# EAGLE design MLP_ESPControlBoard_Rev_1 (EAGLE 7.6.0)
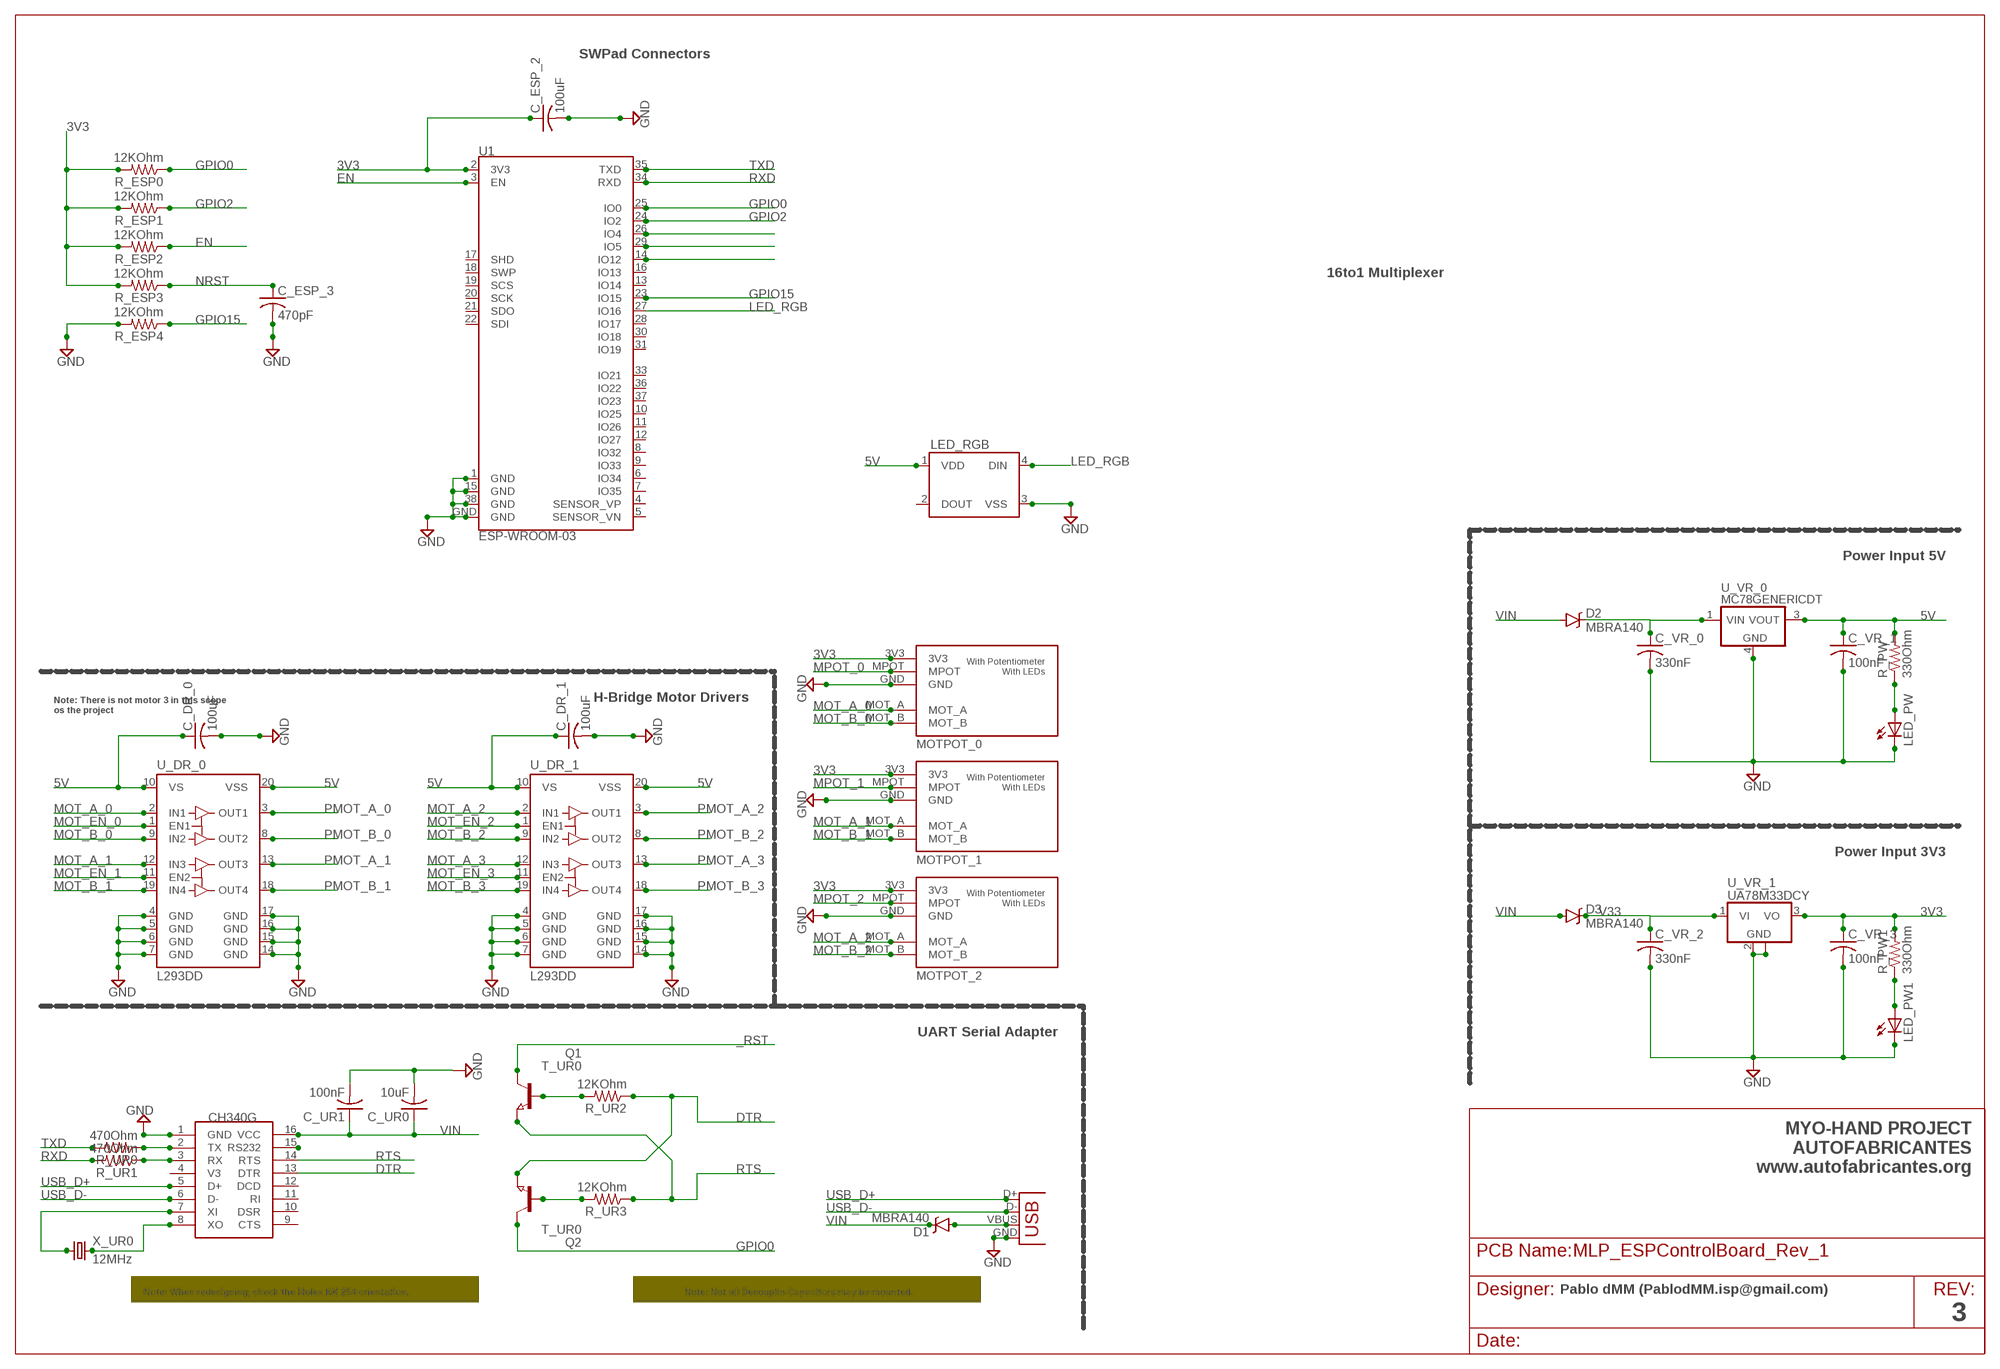
[diagram p0: schematic, sheet 1]

## Parts
C_DR_0  100uF  C-USC0805K  [C0805K]
C_DR_1  100uF  C-USC0805K  [C0805K]
C_ESP_2  100uF  C-USC0805K  [C0805K]
C_ESP_3  470pF  C-USC0805K  [C0805K]
C_UR0  10uF  C-USC0805K  [C0805K]
C_UR1  100nF  C-USC0805K  [C0805K]
C_VR_0  330nF  C-USC1206K  [C1206K]
C_VR_1  100nF  C-USC1206K  [C1206K]
C_VR_2  330nF  C-USC1206K  [C1206K]
C_VR_3  100nF  C-USC1206K  [C1206K]
D1  MBRA140  [SMA-DIODE]
D2  MBRA140  [SMA-DIODE]
D3  MBRA140  [SMA-DIODE]
LED_PW  LEDSMT1206  [1206]
LED_PW1  LEDSMT1206  [1206]
LED_RGB  WS2812B  [WS2812B]
MOTPOT_0  POLOLU_MOT_POT  [POLOLU_MOT_POT]
MOTPOT_1  POLOLU_MOT_POT  [POLOLU_MOT_POT]
MOTPOT_2  POLOLU_MOT_POT  [POLOLU_MOT_POT]
Q1  T_UR0  NPN-TRANSISTOR_SOT23  [SOT23]
Q2  T_UR0  NPN-TRANSISTOR_SOT23  [SOT23]
R_ESP0  12KOhm  R-US_M0805  [M0805]
R_ESP1  12KOhm  R-US_M0805  [M0805]
R_ESP2  12KOhm  R-US_M0805  [M0805]
R_ESP3  12KOhm  R-US_M0805  [M0805]
R_ESP4  12KOhm  R-US_M0805  [M0805]
R_PW  330Ohm  R-US_M1206  [M1206]
R_PW1  330Ohm  R-US_M1206  [M1206]
R_UR0  470Ohm  R-US_M1206  [M1206]
R_UR1  470Ohm  R-US_M1206  [M1206]
R_UR2  12KOhm  R-US_M1206  [M1206]
R_UR3  12KOhm  R-US_M1206  [M1206]
U1  ESP-WROOM-03  [ESP-WROOM-03]
U_DR_0  L293DD  [SO20]
U_DR_1  L293DD  [SO20]
U_UR0  CH340G  [SOIC16]
U_VR_0  MC78GENERICDT  [DPAK-3]
U_VR_1  UA78M33DCY  [SOT223]
X1  USB-MICROB  [USB-MICROB]
X_UR0  12MHz  CRYSTALCTS406  [CTS406]

## Nets
3V3: C_ESP_2.1 C_VR_3.1 MOTPOT_0.3V3 MOTPOT_1.3V3 MOTPOT_2.3V3 R_ESP0.2 R_ESP1.2 R_ESP2.2 R_ESP3.2 R_PW1.2 U1.2(3V3) U_VR_1.3(VO)
5V [GND]: C_DR_0.1 C_DR_1.1 C_VR_1.1 LED_RGB.1(VDD) R_PW.2 U_DR_0.10(VS) U_DR_0.20(VSS) U_DR_1.10(VS) U_DR_1.20(VSS) U_VR_0.3(VOUT)
_RST: Q1.3(C)
DTR: Q2.2(E) R_UR2.1 U_UR0.13(DTR)
EN: R_ESP2.1 U1.3(EN)
GND [GND]: C_DR_0.2 C_DR_1.2 C_ESP_2.2 C_ESP_3.2 C_UR0.2 C_UR1.2 C_VR_0.2 C_VR_1.2 C_VR_2.2 C_VR_3.2 LED_PW1.C LED_PW.C LED_RGB.3(VSS) MOTPOT_0.GND MOTPOT_1.GND MOTPOT_2.GND R_ESP4.2 U1.1(GND) U1.15(GND) U1.38(GND) U1.GND U_DR_0.4(GND) U_DR_0.5(GND) U_DR_0.6(GND) U_DR_0.7(GND) U_DR_0.14(GND) U_DR_0.15(GND) U_DR_0.16(GND) U_DR_0.17(GND) U_DR_1.4(GND) U_DR_1.5(GND) U_DR_1.6(GND) U_DR_1.7(GND) U_DR_1.14(GND) U_DR_1.15(GND) U_DR_1.16(GND) U_DR_1.17(GND) U_UR0.1(GND) U_VR_0.4(GND) U_VR_1.2(GND) U_VR_1.4(GND) X1.GND
GPIO0: Q2.3(C) R_ESP0.1 U1.25(IO0)
GPIO2: R_ESP1.1 U1.24(IO2)
GPIO15: R_ESP4.1 U1.23(IO15)
LED_RGB: LED_RGB.4(DIN) U1.27(IO16)
MOT_A_0: MOTPOT_0.MOT_A U_DR_0.2(IN1)
MOT_A_1: MOTPOT_1.MOT_A U_DR_0.12(IN3)
MOT_A_2: MOTPOT_2.MOT_A U_DR_1.2(IN1)
MOT_A_3: U_DR_1.12(IN3)
MOT_B_0: MOTPOT_0.MOT_B U_DR_0.9(IN2)
MOT_B_1: MOTPOT_1.MOT_B U_DR_0.19(IN4)
MOT_B_2: MOTPOT_2.MOT_B U_DR_1.9(IN2)
MOT_B_3: U_DR_1.19(IN4)
MOT_EN_0: U_DR_0.1(EN1)
MOT_EN_1: U_DR_0.11(EN2)
MOT_EN_2: U_DR_1.1(EN1)
MOT_EN_3: U_DR_1.11(EN2)
MPOT_0: MOTPOT_0.MPOT
MPOT_1: MOTPOT_1.MPOT
MPOT_2: MOTPOT_2.MPOT
N$2: U_UR0.15(RS232)
N$3: Q2.1(B) R_UR3.2
N$4: Q1.1(B) R_UR2.2
N$5: LED_PW.A R_PW.1
N$7: U_UR0.7(XI) X_UR0.1
N$8: LED_PW1.A R_PW1.1
N$10: U1.26(IO4)
N$12: R_UR0.1 U_UR0.2(TX)
N$13: R_UR1.1 U_UR0.3(RX)
N$14: U_UR0.8(XO) X_UR0.3
N$15: D1.A X1.VBUS
N$16: U1.29(IO5)
N$17: U1.14(IO12)
NRST: C_ESP_3.1 R_ESP3.1
PMOT_A_0: U_DR_0.3(OUT1)
PMOT_A_1: U_DR_0.13(OUT3)
PMOT_A_2: U_DR_1.3(OUT1)
PMOT_A_3: U_DR_1.13(OUT3)
PMOT_B_0: U_DR_0.8(OUT2)
PMOT_B_1: U_DR_0.18(OUT4)
PMOT_B_2: U_DR_1.8(OUT2)
PMOT_B_3: U_DR_1.18(OUT4)
RTS: Q1.2(E) R_UR3.1 U_UR0.14(RTS)
RXD: R_UR1.2 U1.34(RXD)
TXD: R_UR0.2 U1.35(TXD)
USB_D+: U_UR0.5(D+) X1.D+
USB_D-: U_UR0.6(D-) X1.D-
V5: C_VR_0.1 D2.C U_VR_0.1(VIN)
V33: C_VR_2.1 D3.C U_VR_1.1(VI)
VIN: C_UR0.1 C_UR1.1 D1.C D2.A D3.A U_UR0.16(VCC)
Unconnected: LED_RGB.2(DOUT) U1.4(SENSOR_VP) U1.5(SENSOR_VN) U1.6(IO34) U1.7(IO35) U1.8(IO32) U1.9(IO33) U1.10(IO25) U1.11(IO26) U1.12(IO27) U1.13(IO14) U1.16(IO13) U1.17(SHD) U1.18(SWP) U1.19(SCS) U1.20(SCK) U1.21(SDO) U1.22(SDI) U1.28(IO17) U1.30(IO18) U1.31(IO19) U1.33(IO21) U1.36(IO22) U1.37(IO23) U_UR0.4(V3) U_UR0.9(CTS) U_UR0.10(DSR) U_UR0.11(RI) U_UR0.12(DCD)

## Notes on the sheet
- SWPad Connectors
- 16to1 Multiplexer
- Power Input 5V
- Note: There is not motor 3 in this scope
  os the project
- H-Bridge Motor Drivers
- Power Input 3V3
- UART Serial Adapter
- MYO-HAND PROJECT
  AUTOFABRICANTES
  www.autofabricantes.org
- Note: When redesigning, check the Molex KK 254 orientation. | Note: Not all Decouplin Capacitors may be mounted. | Pablo dMM (PablodMM.isp@gmail.com)
- 3

## Library data of the parts
C_DR_0 C_DR_1 C_ESP_2 C_ESP_3 C_UR0 C_UR1 C_VR_0 C_VR_1-C_VR_3 = adafruit:C-US: CAPACITOR, American symbol
D1-D3 = SparkFun-DiscreteSemi:MBRA140: 40V, 1A Schottky rectifier SMA/DO-214AC package DIO-08053; PROD_ID: DIO-08053
LED_PW LED_PW1 = adafruit:LED: LED OSRAM: - CHIPLED LG R971, LG N971, LY N971, LG Q971, LY Q971, LO R971, LY R971 LH N974, LH R974 LS Q976, LO Q976, LY Q976 LO Q996 - Hyper CHIPLED LW Q18S LB Q993, LB Q99A, LB R99A - SideLED LS A670, LO A670, LY A670, LG A670, LP A670 LB A673, LV A673, LT A673, LW A673 LH A674 LY A675 LS A676, LA A676, LO A676, LY A676, LW A676 LS A679, LY A679, LG A679 - Hyper Micro SIDELED® LS Y876, LA Y876, LO Y876, LY Y876 LT Y87S - SmartLED LW L88C, LW L88S LB L89C, LB L89S, LG L890 LS L89K, LO L89K, LY L89K LS L896, LA L896, LO L896, LY L896 - TOPLED LS T670, LO T670, LY T670, LG T670, LP T670 LSG T670, LSP T670, LSY T670, LOP T670, LYG T670 LG T671, LOG T671, LSG T671 LB T673, LV T673, LT T673, LW T673 LH T674 LS T676, LA T676, LO T676, LY T676, LB T676, LH T676, LSB T676, LW T676 LB T67C, LV T67C, LT T67C, LS T67K, LO T67K, LY T67K, LW E67C LS E67B, LA E67B, LO E67B, LY E67B, LB E67C, LV E67C, LT E67C LW T67C LS T679, LY T679, LG T679 LS T770, LO T770, LY T770, LG T770, LP T770 LB T773, LV T773, LT T773, LW T773 LH T774 LS E675, LA E675, LY E675, LS T675 LS T776, LA T776, LO T776, LY T776, LB T776 LHGB T686 LT T68C, LB T68C - Hyper Mini TOPLED® LB M676 - Mini TOPLED Santana® LG M470 LS M47K, LO M47K, LY M47K Source: http://www.osram.convergy.de/
LED_RGB = SparkFun-LED:WS2812B: WS2812B - Intelligent control LED integrated light source Technical Specifications: Power Supply Voltage (VDD): 3.5 to 5.3 V Input Voltage (VI): -0.5 to VDD+0.5 V Operating Junction Temperature (Topt): -25°C to +80°C Storage Temperature Range (Tstg): -55°C to +150°C; PROD_ID: DIO-12503
MOTPOT_0 MOTPOT_1 MOTPOT_2 = PololuMotors:POLOLU_MOT_POT: Pololu Small Gearmotor with mechanical attach. With LEDs
Q1 Q2 = semicon-smd-ipc:NPN-TRANSISTOR_: NPN TRANSISTOR
R_ESP0 R_ESP1-R_ESP4 R_PW R_PW1 R_UR0 R_UR1-R_UR3 = adafruit:R-US_: RESISTOR, American symbol
U1 = esp32:ESP-WROOM-03
U_DR_0 U_DR_1 = st-microelectronics:L293DD: PUSH-PULL FOUR CHANNEL DRIVER WITH DIODES Source: http://www.st.com/stonline/books/pdf/docs/1330.pdf; OC_FARNELL: unknown
U_UR0 = ch340g:CH340G
U_VR_0 = _hhn_78xx_79xx_NCV78xx_d2pak_dpak:MC78*: 78xx SMD (D2PAK, DPAK) (MC)78xx..DT (DPAK-3; Rth,JA = 92 K/W) (MC)78xx..D2T (D2PAK-3; Rth,JA = 45 K/W @ 10x10mm copper area) Linear Voltage Regulators, Positive, 1 A (ON Semiconductor) Package dimenisions and soldering footprints acc. to ONSEMI specs. Source: http://onsemi.com Datasheet document#: MC7800/D Technologies: 78xxyD(2)Tz: xx = Output Voltage (V) y, z: additional suffixes see manufacturer's datasheet Author: Dipl.-Ing. FH Rainer Bayer HHN Hochschule Heilbronn, rainer.bayer@hs-heilbronn.de Ingenieurbüro ing-rb, mail@ing-rb.de
U_VR_1 = linear:UA78M*: POSITIVE-VOLTAGE REGULATORS Source: http://focus.ti.com/lit/ds/symlink/ua78m33.pdf
X1 = SparkFun:USB: USB Connectors USB-B-PTH is fully proven SKU : PRT-00139 USB-miniB is fully proven SKU : PRT-00587 USB-A-PCB is untested. USB-A-H is throughly reviewed, but untested. Spark Fun Electronics SKU : PRT-00437 USB-B-SMT is throughly reviewed, but untested. Needs silkscreen touching up. USB-A-S has not been used/tested USB-MB-H has not been used/tested
X_UR0 = adafruit:CRYSTAL: CRYSTAL; OC_FARNELL: unknown; OC_NEWARK: unknown

## Net classes
1 GND: width 0.635 mm

## Board
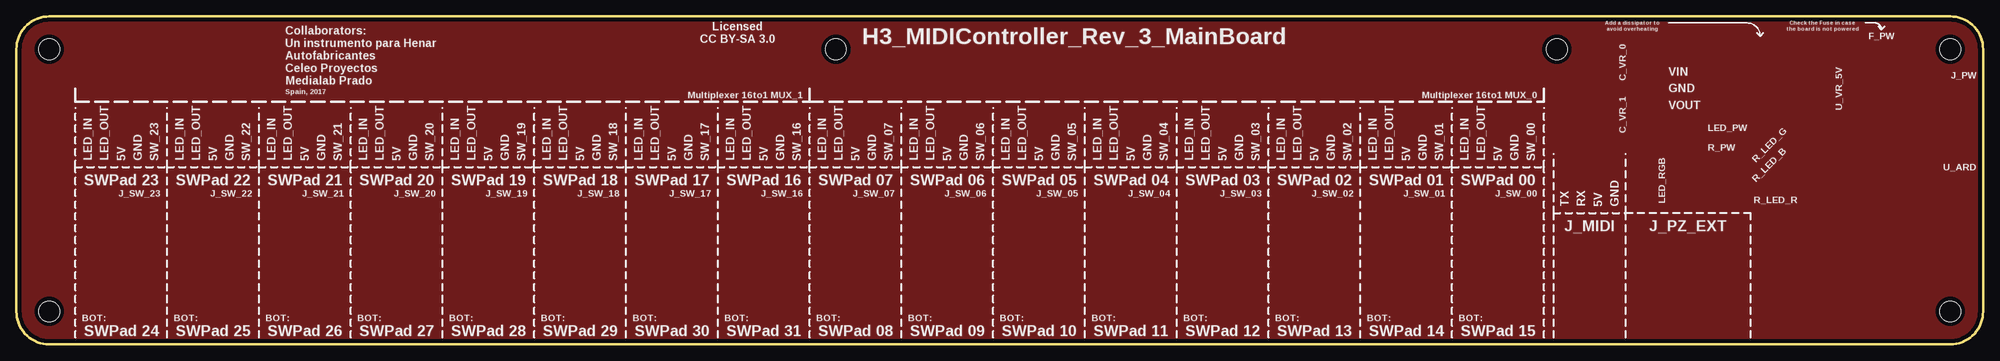
[diagram p1: board, top side]
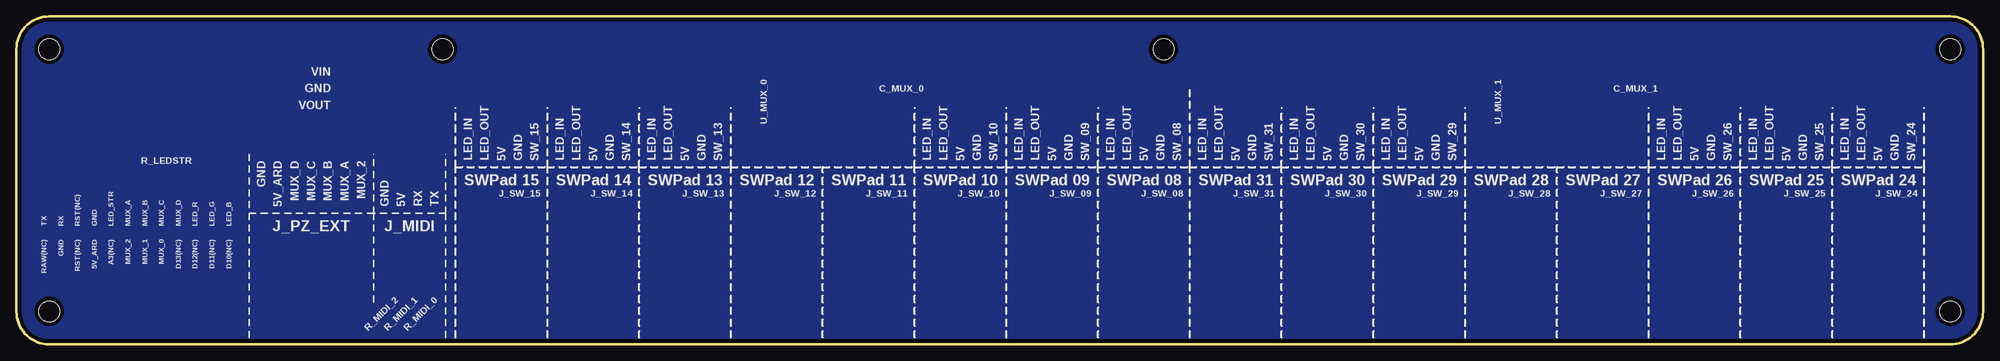
[diagram p2: board, bottom side, seen from below]

Size 300 x 50 mm. Coordinates in mm from the lower left corner, seen from the top.
Outline: 5,0 295,0 arc90 300,5 300,45 arc90 295,50 5,50 arc90 0,45 0,5 arc90 5,0
Copper layers (1*16): Top 0.035mm / dielectric 1.5mm / Bottom 0.035mm
Design rules "default *": minimum track width 10mil, minimum drill 25mil, track to track 10mil, track to pad 10mil, pad to pad 10mil, via to via 10mil, smd to smd 8mil, copper to edge 20mil, drill to drill 8mil, minimum pad ring 10mil, minimum via ring 15mil, stop-mask expansion 4mil, vias tented up to drill 0mil, thermal gap 10mil
Holes 3.2 mm at 5,5 5,45 295,45 295,5 235,45 125,45

### Footprints (pad centres in the part's own frame; a part is rotated, then mirrored left to right if it is on the bottom)
C0805K = smd 1.1 x 1.4: 1 -1,0; 2 1,0
C1206K = smd 1.5 x 2: 1 -1.5,0; 2 1.5,0
SMA-DIODE = smd 1.27 x 1.47: A -2.15,0; C 2.15,0
1206 = smd 1.6 x 1.803: A -1.422,0; C 1.422,0
WS2812B = smd 1.651 x 1: 1 -2.577,1.6; 2 -2.577,-1.6; 3 2.577,-1.6; 4 2.577,1.6
POLOLU_MOT_POT = drill 1 pad 2.184: 3V3 2.54,17; GND -2.54,17; MPOT 0,17 | smd 3.81 x 1.93: MOT_A -6.5,-12.5; MOT_B 6.5,-12.5 | smd 1.676 x 0.813: P$4 -3.5,-12; P$5 -3.5,-14.5; P$6 -1,-12; P$7 -1,-14.5; P$8 1,-12; P$9 1,-14.5; P$10 3.5,-12; P$11 3.5,-14.5 | hole 2.2: -9.5,1; 9.5,1
SOT23 = smd 1 x 1.4: 1 -0.95,-1.1; 2 0.95,-1.1; 3 0,1.1
M0805 = smd 1.3 x 1.6: 1 -0.95,0; 2 0.95,0
M1206 = smd 1.6 x 2: 1 -1.4,0; 2 1.4,0
ESP-WROOM-03 = smd 0.9 x 1.5: 1 7.7,9; 2 6.43,9; 3 5.16,9; 4 3.89,9; 5 2.62,9; 6 1.35,9; 7 0.08,9; 8 -1.19,9; 9 -2.46,9; 10 -3.73,9; 11 -5,9; 12 -6.27,9; 13 -7.54,9; 14 -8.81,9; 25 -8.81,-9; 26 -7.54,-9; 27 -6.27,-9; 28 -5,-9; 29 -3.73,-9; 30 -2.46,-9; 31 -1.19,-9; 32 0.08,-9; 33 1.35,-9; 34 2.62,-9; 35 3.89,-9; 36 5.16,-9; 37 6.43,-9; 38 7.7,-9 | smd 1.5 x 0.9: 15 -10.3,5.715; 16 -10.3,4.445; 17 -10.3,3.175; 18 -10.3,1.905; 19 -10.3,0.635; 20 -10.3,-0.635; 21 -10.3,-1.905; 22 -10.3,-3.175; 23 -10.3,-4.445; 24 -10.3,-5.715 | smd 6 x 6: GND 0,0
SO20 = smd 0.6 x 2.2: 1 -5.715,-4.6; 2 -4.445,-4.6; 3 -3.175,-4.6; 4 -1.905,-4.6; 5 -0.635,-4.6; 6 0.635,-4.6; 7 1.905,-4.6; 8 3.175,-4.6; 9 4.445,-4.6; 10 5.715,-4.6; 11 5.715,4.6; 12 4.445,4.6; 13 3.175,4.6; 14 1.905,4.6; 15 0.635,4.6; 16 -0.635,4.6; 17 -1.905,4.6; 18 -3.175,4.6; 19 -4.445,4.6; 20 -5.715,4.6
SOIC16 = smd 0.635 x 1.524: 1 -4.445,-2.695; 2 -3.175,-2.695; 3 -1.905,-2.695; 4 -0.635,-2.695; 5 0.635,-2.695; 6 1.905,-2.695; 7 3.175,-2.695; 8 4.445,-2.695; 9 4.445,2.695; 10 3.175,2.695; 11 1.905,2.695; 12 0.635,2.695; 13 -0.635,2.695; 14 -1.905,2.695; 15 -3.175,2.695; 16 -4.445,2.695
DPAK-3 = smd 1.6 x 3: 1 -2.286,-7.18; 3 2.286,-7.18 | smd 6.2 x 5.8: 4 0,0
SOT223 = smd 1.219 x 2.235: 1 -2.311,-3.099; 2 0,-3.099; 3 2.311,-3.099 | smd 3.6 x 2.2: 4 0,3.099
USB-MICROB = smd 0.35 x 1.4: D+ 0,2.65; D- -0.65,2.65; GND 1.3,2.65; ID 0.65,2.65; VBUS -1.3,2.65 | smd 1.8 x 1.9: MT1 -4,0; MT2 4,0
CTS406 = smd 1.9 x 1.4: 1 -2.2,-1.2; 2 2.2,-1.2; 3 2.2,1.2; 4 -2.2,1.2

### Placement (x,y rotation side)
C_DR_0  -102,-40 0 top  (outside the outline)
C_DR_1  -89,-61 0 top  (outside the outline)
C_ESP_2  -195,-163 0 top  (outside the outline)
C_ESP_3  -195,-168 0 top  (outside the outline)
C_UR0  -126,-70 0 top  (outside the outline)
C_UR1  -99,-28 90 top  (outside the outline)
C_VR_0  -192,-115 0 top  (outside the outline)
C_VR_1  -192,-119 0 top  (outside the outline)
C_VR_2  -192,-123 0 top  (outside the outline)
C_VR_3  -192,-127 0 top  (outside the outline)
D1  -75,-41 90 top  (outside the outline)
D2  -195,-22 0 top  (outside the outline)
D3  -195,-28 0 top  (outside the outline)
LED_PW  -39,-36 180 top  (outside the outline)
LED_PW1  -192,-111 0 top  (outside the outline)
LED_RGB  -86,16 0 top  (outside the outline)
MOTPOT_0  -100,2 0 top  (outside the outline)
MOTPOT_1  -125,2 0 top  (outside the outline)
MOTPOT_2  -150,2 0 top  (outside the outline)
Q1  -51,-18 0 top  (outside the outline)
Q2  -46,-18 0 top  (outside the outline)
R_ESP0  -195,-133 0 top  (outside the outline)
R_ESP1  -195,-139 0 top  (outside the outline)
R_ESP2  -195,-145 0 top  (outside the outline)
R_ESP3  -195,-151 0 top  (outside the outline)
R_ESP4  -195,-157 0 top  (outside the outline)
R_PW  -32,-47 180 top  (outside the outline)
R_PW1  -171,-34 0 top  (outside the outline)
R_UR0  -37,-4 0 top  (outside the outline)
R_UR1  -37,-11 0 top  (outside the outline)
R_UR2  -47,-24 180 top  (outside the outline)
R_UR3  -50,-29 0 top  (outside the outline)
U1  -174,0 90 top  (outside the outline)
U_DR_0  -158,-21 270 top  (outside the outline)
U_DR_1  -144,-21 270 top  (outside the outline)
U_UR0  -131,-23 270 top  (outside the outline)
U_VR_0  -170,-19 0 top  (outside the outline)
U_VR_1  -179,-20 0 top  (outside the outline)
X1  -122,-23 270 top  (outside the outline)
X_UR0  -77,-34 0 top  (outside the outline)

### Tracks (layer width: path | path; a pad name or v marks a point on that pad's centre or on a via)
3V3  (11 unrouted)
5V  (9 unrouted)
DTR  (2 unrouted)
EN  (1 unrouted)
GND  (41 unrouted)
  pour Top (isolate 0.61): 5,0 295,0 arc90 300,5 300,45 arc90 295,50 5,50 arc90 0,45 0,5 arc90
  pour Bottom (isolate 0.61): 5,50 arc90 0,45 0,5 arc90 5,0 295,0 arc90 300,5 300,45 arc90 295,50
GPIO0  (2 unrouted)
GPIO2  (1 unrouted)
GPIO15  (1 unrouted)
LED_RGB  (1 unrouted)
MOT_A_0  (1 unrouted)
MOT_A_1  (1 unrouted)
MOT_A_2  (1 unrouted)
MOT_B_0  (1 unrouted)
MOT_B_1  (1 unrouted)
MOT_B_2  (1 unrouted)
N$3  (1 unrouted)
N$4  (1 unrouted)
N$5  (1 unrouted)
N$6
  pour Top (isolate 0.61): 0,5 arc90 5,0 295,0 arc90 300,5 300,45 arc90 295,50 5,50 arc90 0,45
N$7  (1 unrouted)
N$8  (1 unrouted)
N$11
  pour Bottom (isolate 0.61): 5,50 arc90 0,45 0,5 arc90 5,0 295,0 arc90 300,5 300,45 arc90 295,50
N$12  (1 unrouted)
N$13  (1 unrouted)
N$14  (1 unrouted)
N$15  (1 unrouted)
NRST  (1 unrouted)
RTS  (2 unrouted)
RXD  (1 unrouted)
TXD  (1 unrouted)
USB_D+  (1 unrouted)
USB_D-  (1 unrouted)
V5  (2 unrouted)
V33  (2 unrouted)
VIN  (5 unrouted)

### Text on the board
t_Silk: Licensed / CC BY-SA 3.0 | Add a dissipator to / avoid overheating | Check the Fuse in case / the board is not powered | H3_MIDIController_Rev_3_MainBoard | F_PW | Collaborators: / Un instrumento para Henar / Autofabricantes / Celeo Proyectos / Medialab Prado | C_VR_0 | J_PW | VIN / GND / VOUT | U_VR_5V | Spain, 2017 | Multiplexer 16to1 MUX_1 | Multiplexer 16to1 MUX_0 | C_VR_1 | LED_PW | R_PW | LED_IN / LED_OUT / 5V / GND / SW_23 | LED_IN / LED_OUT / 5V / GND / SW_22 | LED_IN / LED_OUT / 5V / GND / SW_21 | LED_IN / LED_OUT / 5V / GND / SW_20 | LED_IN / LED_OUT / 5V / GND / SW_19 | LED_IN / LED_OUT / 5V / GND / SW_18 | LED_IN / LED_OUT / 5V / GND / SW_17 | LED_IN / LED_OUT / 5V / GND / SW_16 | LED_IN / LED_OUT / 5V / GND / SW_07 | LED_IN / LED_OUT / 5V / GND / SW_06 | LED_IN / LED_OUT / 5V / GND / SW_05 | LED_IN / LED_OUT / 5V / GND / SW_04 | LED_IN / LED_OUT / 5V / GND / SW_03 | LED_IN / LED_OUT / 5V / GND / SW_02 | LED_IN / LED_OUT / 5V / GND / SW_01 | LED_IN / LED_OUT / 5V / GND / SW_00 | R_LED_G | U_ARD | SWPad 23 | SWPad 22 | SWPad 21 | SWPad 20 | SWPad 19 | SWPad 18 | SWPad 17 | SWPad 16 | SWPad 07 | SWPad 06 | SWPad 05 | SWPad 04 | SWPad 03 | SWPad 02 | SWPad 01 | SWPad 00 | LED_RGB | R_LED_B | J_SW_23 | J_SW_22 | J_SW_21 | J_SW_20 | J_SW_19 | J_SW_18 | J_SW_17 | J_SW_16 | J_SW_07 | J_SW_06 | J_SW_05 | J_SW_04 | J_SW_03 | J_SW_02 | J_SW_01 | J_SW_00 | R_LED_R | TX / RX / 5V / GND | J_MIDI | J_PZ_EXT | BOT: | BOT: | BOT: | BOT: | BOT: | BOT: | BOT: | BOT: | BOT: | BOT: | BOT: | BOT: | BOT: | BOT: | BOT: | BOT: | SWPad 24 | SWPad 25 | SWPad 26 | SWPad 27 | SWPad 28 | SWPad 29 | SWPad 30 | SWPad 31 | SWPad 08 | SWPad 09 | SWPad 10 | SWPad 11 | SWPad 12 | SWPad 13 | SWPad 14 | SWPad 15
b_Silk: C_MUX_1 | C_MUX_0 | VIN / GND / VOUT | U_MUX_1 | U_MUX_0 | LED_IN / LED_OUT / 5V / GND / SW_24 | LED_IN / LED_OUT / 5V / GND / SW_25 | LED_IN / LED_OUT / 5V / GND / SW_26 | LED_IN / LED_OUT / 5V / GND / SW_29 | LED_IN / LED_OUT / 5V / GND / SW_30 | LED_IN / LED_OUT / 5V / GND / SW_31 | LED_IN / LED_OUT / 5V / GND / SW_08 | LED_IN / LED_OUT / 5V / GND / SW_09 | LED_IN / LED_OUT / 5V / GND / SW_10 | LED_IN / LED_OUT / 5V / GND / SW_13 | LED_IN / LED_OUT / 5V / GND / SW_14 | LED_IN / LED_OUT / 5V / GND / SW_15 | GND / 5V_ARD / MUX_D / MUX_C / MUX_B / MUX_A / MUX_2 | R_LEDSTR | SWPad 24 | SWPad 25 | SWPad 26 | SWPad 27 | SWPad 28 | SWPad 29 | SWPad 30 | SWPad 31 | SWPad 08 | SWPad 09 | SWPad 10 | SWPad 11 | SWPad 12 | SWPad 13 | SWPad 14 | SWPad 15 | J_SW_24 | J_SW_25 | J_SW_26 | J_SW_27 | J_SW_28 | J_SW_29 | J_SW_30 | J_SW_31 | J_SW_08 | J_SW_09 | J_SW_10 | J_SW_11 | J_SW_12 | J_SW_13 | J_SW_14 | J_SW_15 | GND / 5V / RX / TX | J_MIDI | J_PZ_EXT | TX / RX / RST(NC) / GND / LED_STR / MUX_A / MUX_B / MUX_C / MUX_D / LED_R / LED_G / LED_B | RAW(NC) / GND / RST(NC) / 5V_ARD / A3(NC) / MUX_2 / MUX_1 / MUX_0 / D13(NC) / D12(NC) / D11(NC) / D10(NC) | R_MIDI_0 | R_MIDI_1 | R_MIDI_2
200bmp: C:/Users/PablodMM/Google Drive/Henar #3/03_Recursos/License_3_0_Logo.bmp